# Altium schematic sheet frm-voltrod_AFE.SchDoc: ANALOG FRONT END
size A3; Organization: Altium Limited; Address1: L3, 12a Rodborough Rd; Address2: Frenchs Forest; Address3: NSW; Address4: Australia 2086; DocumentNumber: 4; SheetNumber: 4; SheetTotal: 4
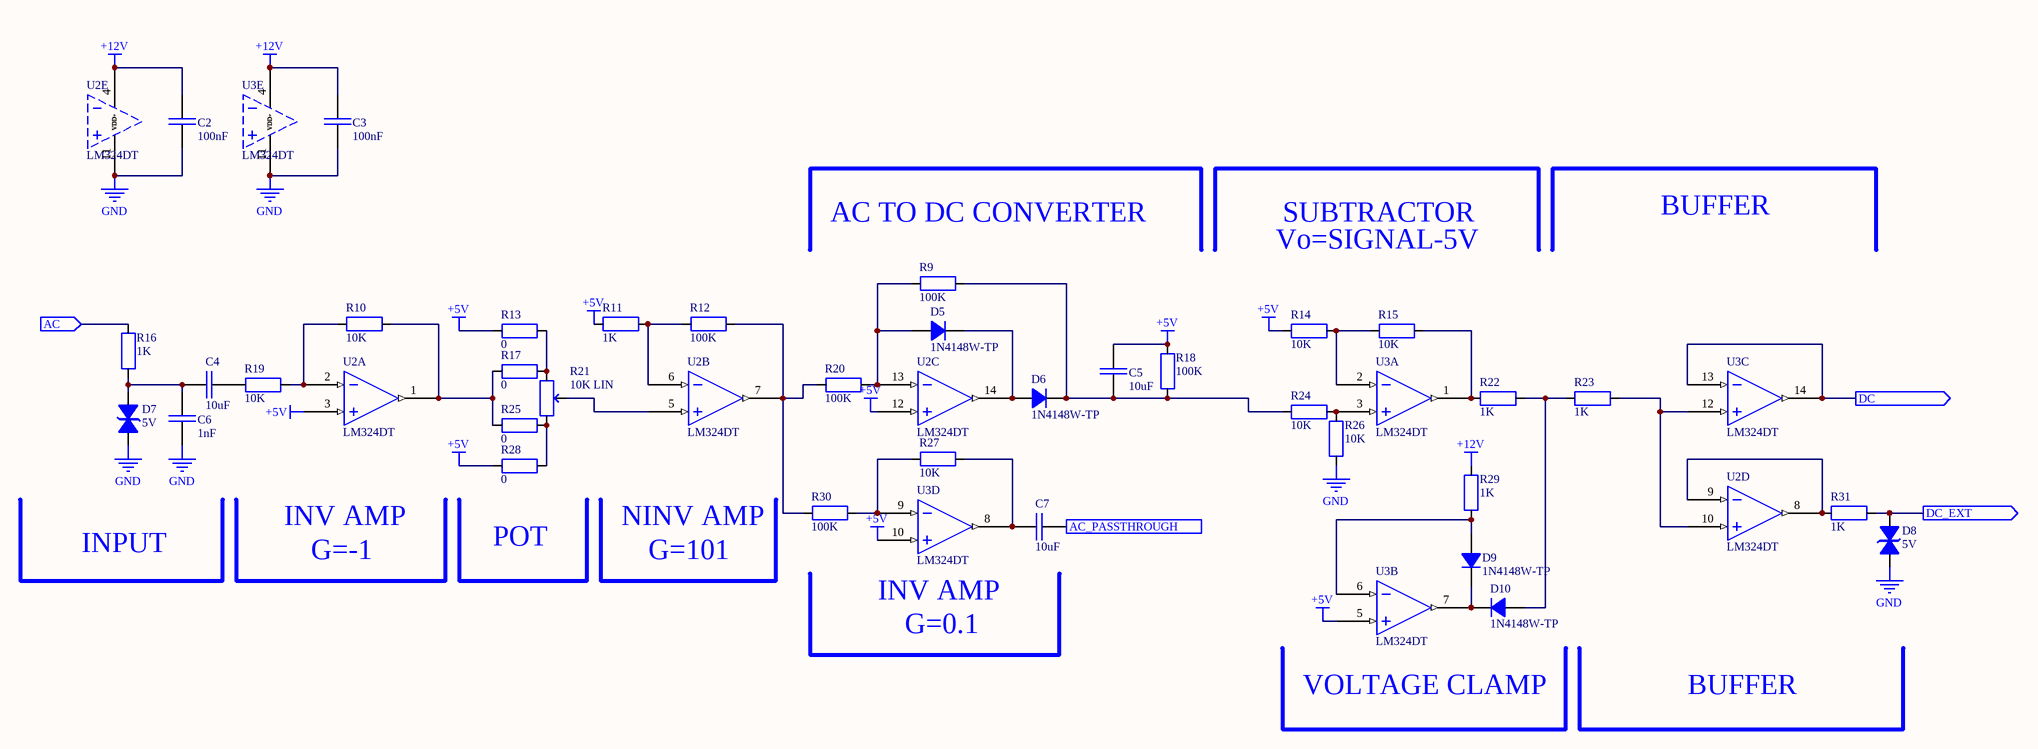
[diagram p0: frm-voltrod_AFE.SchDoc]

## Parts
C2  100nF  [CAP 0603_1608]
C3  100nF  [CAP 0603_1608]
C4  10uF  [CAP 0805_2012]
C5  10uF  [CAP 0805_2012]
C6  1nF  [CAP 0603_1608]
C7  10uF  [CAP 0805_2012]
D5  1N4148W-TP  [SOD-123]
D6  1N4148W-TP  [SOD-123]
D7  5V  [SOD523F]
D8  5V  [SOD523F]
D9  1N4148W-TP  [SOD-123]
D10  1N4148W-TP  [SOD-123]
R9  100K  [RES 0603_1608]
R10  10K  [RES 0603_1608]
R11  1K  [RES 0603_1608]
R12  100K  [RES 0603_1608]
R13  0  [RES 0603_1608]
R14  10K  [RES 0603_1608]
R15  10K  [RES 0603_1608]
R16  1K  [RES 0603_1608]
R17  0  [RES 0603_1608]
R18  100K  [RES 0603_1608]
R19  10K  [RES 0603_1608]
R20  100K  [RES 0603_1608]
R21  10K LIN  [2EF88547-EDEF-4A49-A522-C215618D4BC7]
R22  1K  [RES 0603_1608]
R23  1K  [RES 0603_1608]
R24  10K  [RES 0603_1608]
R25  0  [RES 0603_1608]
R26  10K  [RES 0603_1608]
R27  10K  [RES 0603_1608]
R28  0  [RES 0603_1608]
R29  1K  [RES 0603_1608]
R30  100K  [RES 0603_1608]
R31  1K  [RES 0603_1608]
U2  LM324DT  [34355DA5-B1DA-47C2-A88A-ECF82120A4F7]  (parts A,B,C,D,E of 5)
U3  LM324DT  [34355DA5-B1DA-47C2-A88A-ECF82120A4F7]  (parts A,B,C,D,E of 5)

## Ports
AC (in), AC_PASSTHROUGH (out), DC (out), DC_EXT (out)

## Nets
+5V: C5.2 R11.2 R13.1 R14.1 R18.1 R28.1 U2.3(IN+) U2.12(IN+) U3.5(IN+) U3.10(IN+)
+12V: C2.1 C3.1 R29.2 U2.4(VDD+) U3.4(VDD+)
GND: C2.2 C3.2 C6.2 D7.2 D8.2 R26.2 U2.11(VDD-) U3.11(VDD-)
AC: R16.2 ; port AC
AC_PASSTHROUGH: C7.2 ; port AC_PASSTHROUGH
DC: U3.13(IN-) U3.14(OUT) ; port DC
DC_EXT: D8.1 R31.1 ; port DC_EXT
NetC4_1: C4.1 C6.1 D7.1 R16.1
NetC4_2: C4.2 R19.1
NetC5_1: C5.1 D6.1(K) R9.2 R18.2 R24.1
NetC7_1: C7.1 R27.2 U3.8(OUT)
NetD5_1: D5.1(K) D6.2(A) U2.14(OUT)
NetD5_2: D5.2(A) R9.1 R20.2 U2.13(IN-)
NetD9_1: D9.1(K) D10.1(K) U3.7(OUT)
NetD9_2: D9.2(A) R29.1 U3.6(IN-)
NetD10_2: D10.2(A) R22.1 R23.2
NetR10_1: R10.1 R19.2 U2.2(IN-)
NetR10_2: R10.2 R17.1 R25.1 U2.1(OUT)
NetR11_1: R11.1 R12.1 U2.6(IN-)
NetR12_2: R12.2 R20.1 R30.1 U2.7(OUT)
NetR13_2: R13.2 R17.2 R21.1
NetR14_2: R14.2 R15.1 U3.2(IN-)
NetR15_2: R15.2 R22.2 U3.1(OUT)
NetR21_2: R21.2 U2.5(IN+)
NetR21_3: R21.3 R25.2 R28.2
NetR23_1: R23.1 U2.10(IN+) U3.12(IN+)
NetR24_2: R24.2 R26.1 U3.3(IN+)
NetR27_1: R27.1 R30.2 U3.9(IN-)
NetR31_2: R31.2 U2.8(OUT) U2.9(IN-)

## Notes on the sheet
- BUFFER
- AC TO DC CONVERTER
- Vo=SIGNAL-5V
- SUBTRACTOR
- INPUT
- INV AMP
- G=-1
- POT
- NINV AMP
- G=101
- (near U3) INV AMP
- G=0.1
- VOLTAGE CLAMP
- Title
- Fermium LABS srl
- Size:
- Date:
- File:
- A4
- Prj
- Time:
- Sheet
- of
- Via Monselice 15a
- 35142 Padova PD
- Italy
- Git Hash:

## Library data of the parts
C2 C3 = 02841f84-ac15-41b5-9e17-915f8f067828: CAP SMD MLCC 100nF 25V 0603 X7R; Manufacturer 1: Samsung Electro-Mechanics; Manufacturer Part Number 1: CL10B104KA8NNNC; id: 14784; S 1: LCSC; SPN 1: C1590; Part Number: 02841f84-ac15-41b5-9e17-915f8f067828; ComponentLink1Description: Datasheet; ComponentLink1URL: http://localhost:8080/static/files/Samsung-Electro-Mechanics-CL10B104KA8NNNC_C15902019-03-10_215548.826887.pdf?Samsung-Electro-Mechanics-CL10B104KA8NNNC_C1590.pdf; Value: 100nF
C4 C5 C7 = 1ffbe5a9-0884-4740-bdad-20a6a98400e6: CAP SMD MLCC 10uF 25V 0805 X5R; Manufacturer 1: Samsung Electro-Mechanics; Manufacturer Part Number 1: CL21A106KAYNNNE; id: 14779; S 1: LCSC; SPN 1: C84416; SPN 2: C15850; Part Number: 1ffbe5a9-0884-4740-bdad-20a6a98400e6; ComponentLink1Description: Datasheet; ComponentLink1URL: http://localhost:8080/static/files/Samsung-Electro-Mechanics-CL21A106KAYNNNE_C158502019-03-10_213827.610739.pdf?Samsung-Electro-Mechanics-CL21A106KAYNNNE_C15850.pdf; Value: 10uF; Manufacturer 2: Murata; Manufacturer Part Number 2: GRM21BR61E106KA73L; S 2: LCSC
C6 = 0eca2548-3630-4fea-a3d5-94248c1cae74: CAP SMD MLCC 1nF 50V 0603 X7R; Manufacturer 1: Samsung Electro-Mechanics; Manufacturer Part Number 1: CL10B102KB8NNNC; id: 14785; S 1: LCSC; SPN 1: C1588; Part Number: 0eca2548-3630-4fea-a3d5-94248c1cae74; ComponentLink1Description: Datasheet; ComponentLink1URL: http://localhost:8080/static/files/Samsung-Electro-Mechanics-CL10B102KB8NNNC_C1588_12019-03-10_215732.131818.pdf?Samsung-Electro-Mechanics-CL10B102KB8NNNC_C1588 (1).pdf; Value: 1nF
D5 D6 D9 D10 = 5e920700-75df-48e3-84dd-8f9f777caed8: DIODE SMD 100V 150mA 1.5Vf SOD-123 4148; Manufacturer 1: MCC; id: 14795; S 1: LCSC; SPN 1: C77978; Part Number: 5e920700-75df-48e3-84dd-8f9f777caed8; ComponentLink1Description: Datasheet; ComponentLink1URL: http://localhost:8080/static/files/Micro-Commercial-Components-MCC-1N4148W-TP_C779782019-04-06_215019.428643.pdf?Micro-Commercial-Components-MCC-1N4148W-TP_C77978.pdf; Manufacturer Part Number 1: 1N4148W-TP
D7 D8 = daa58212-38e2-4326-a156-8e48058c46f1: DIODE SMD TVS 5V BIDIRECTIONAL SOD-523; Manufacturer 1: Born Semiconductor; Manufacturer Part Number 1: PESD5V0S1BBN; id: 14837; S 1: LCSC; SPN 1: C97640; SPN 2: C314264; Part Number: daa58212-38e2-4326-a156-8e48058c46f1; ComponentLink1Description: Datasheet; ComponentLink1URL: http://localhost:8080/static/files/Nexperia-PESD5V0S1BB-115_C976402019-08-16_201905.624024.pdf?Nexperia-PESD5V0S1BB-115_C97640.pdf; Value: 5V; ComponentLink2Description: Datasheet; ComponentLink2URL: http://localhost:8080/static/files/1901051701_Bourne-Semicon-Shenzhen-PESD5V0S1BBN_C3142642019-08-16_201911.992552.pdf?1901051701_Bourne-Semicon-Shenzhen-PESD5V0S1BBN_C314264.pdf; Manufacturer 2: Nexperia; Manufacturer Part Number 2: PESD5V0S1BB,115; S 2: LCSC
R9 R12 R18 R20 R30 = 76af10b3-9d85-4b5c-a2d6-26cc74f432f7: RES SMD 100K OHM 1% 1/10W 0603; Manufacturer 1: Yageo; Manufacturer Part Number 1: RC0603FR-07100KL; id: 12746; S 1: LCSC; SPN 1: C14675; Part Number: 76af10b3-9d85-4b5c-a2d6-26cc74f432f7; Value: 100K
R10 R14 R15 R19 R24 R26 R27 = 93242766-ba1d-462d-b58f-ce1dfc4129c8: RES SMD 10K OHM 1% 1/10W 0603; Manufacturer 1: Yageo; Manufacturer Part Number 1: RC0603FR-0710KL; id: 12101; S 1: LCSC; SPN 1: C98220; Part Number: 93242766-ba1d-462d-b58f-ce1dfc4129c8; Value: 10K
R11 R16 R22 R23 R29 R31 = a678220f-9e9d-4863-a833-9993504f723c: RES SMD 1K OHM 1% 1/10W 0603; Manufacturer 1: Yageo; Manufacturer Part Number 1: RC0603FR-071KL; id: 14794; S 1: LCSC; SPN 1: C22548; Part Number: a678220f-9e9d-4863-a833-9993504f723c; Value: 1K
R13 R17 R25 R28 = 6ae227f9-847f-4766-8522-e11a83531204: RES SMD 0 OHM 5% 1/10W 0603; Manufacturer 1: Yageo; Manufacturer Part Number 1: RC0603JR-070RL; id: 11973; S 1: LCSC; SPN 1: C95177; Part Number: 6ae227f9-847f-4766-8522-e11a83531204; Value: 0
R21 = 3df905ea-1e80-4add-859d-a36edd7f106c: POT 10K 20% SHAFT 6mmx7.4mm LIN; Manufacturer 1: ALPS; Manufacturer Part Number 1: RK09K1130A6S; id: 14828; S 1: LCSC; SPN 1: C209770; Part Number: 3df905ea-1e80-4add-859d-a36edd7f106c; ComponentLink1Description: 3D Model; ComponentLink1URL: http://localhost:8080/static/files/RK09K1130A6S2019-08-17_031625.830758.zip?RK09K1130A6S.zip; Value: 10K LIN; ComponentLink2Description: Datasheet; ComponentLink2URL: http://localhost:8080/static/files/ALPS-Electric-RK09K1130A6S_C2097702019-08-17_031651.036431.pdf?ALPS-Electric-RK09K1130A6S_C209770.pdf
U2 U3 = 21a85167-c328-42f7-a52e-365842c6dad3: IC SMD OPAMP LM324DT SO-14; Manufacturer 1: ST Microelectronics; id: 14792; S 1: LCSC; SPN 1: C71035; Part Number: 21a85167-c328-42f7-a52e-365842c6dad3; ComponentLink1Description: Datasheet; ComponentLink1URL: http://localhost:8080/static/files/STMicroelectronics-LM324DT_C710352019-04-06_191500.254110.pdf?STMicroelectronics-LM324DT_C71035.pdf; Manufacturer Part Number 1: LM324DT